# Altium schematic sheet Sch_pwr_brd_MCU.SchDoc
size A
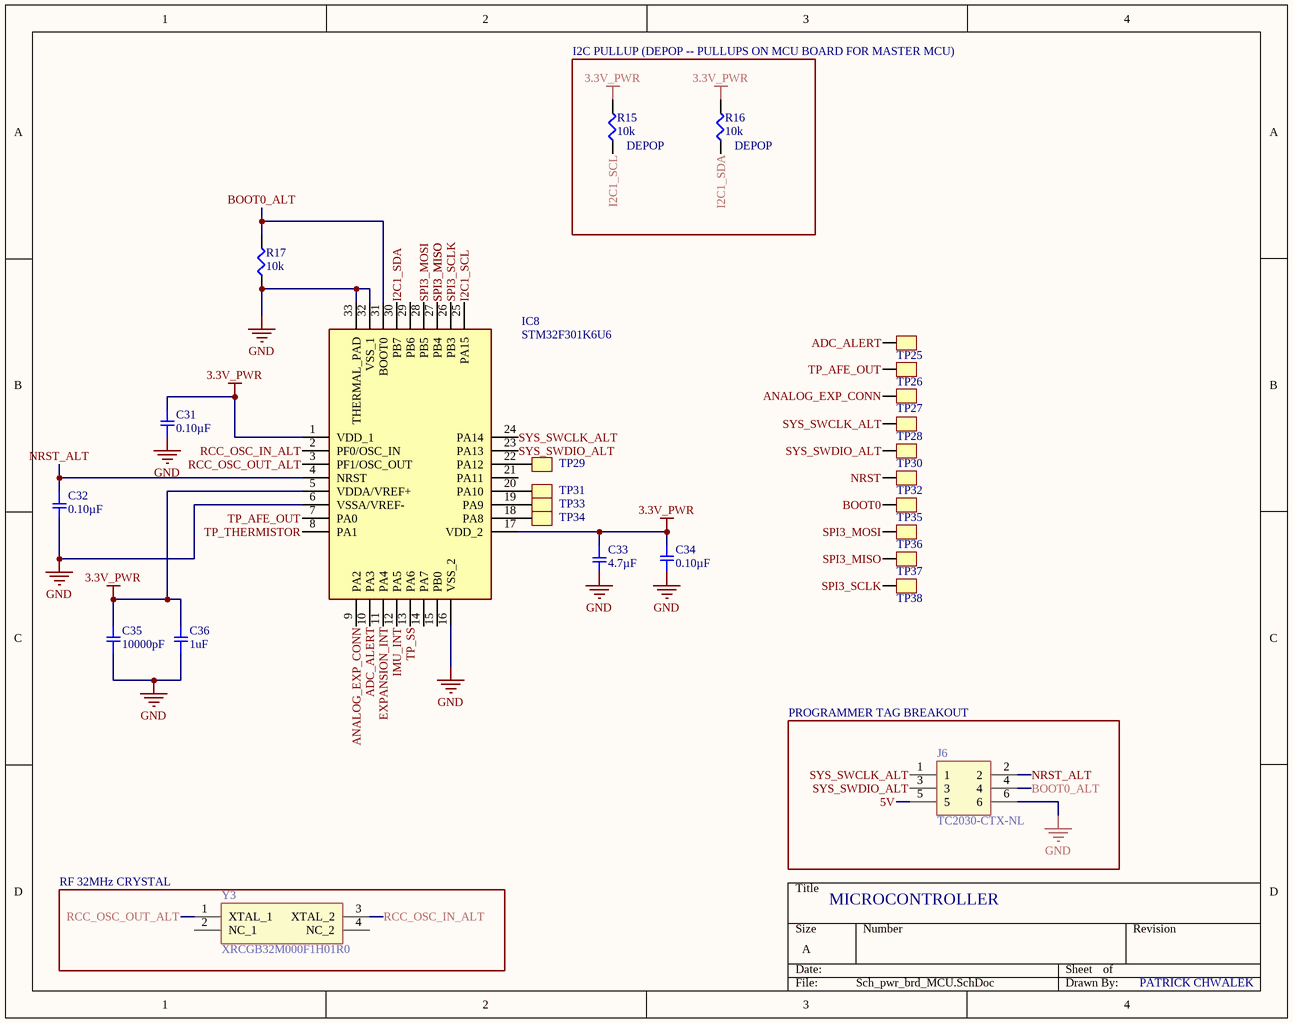
[diagram p0: Sch_pwr_brd_MCU.SchDoc]

## Parts
C31  0.10µF  [SMD-0402C]
C32  0.10µF  [SMD-0402C]
C33  4.7µF  [SMD-0402C]
C34  0.10µF  [SMD-0402C]
C35  10000pF  [SMD-0402C]
C36  1uF  [SMD-0402C]
IC8  STM32F301K6U6  [QFN50P500X500X60-33N-D]
J6  TC2030-CTX-NL  [TC2030MCPNL10]
R15  10k  [SMD-0402-RES]
R16  10k  [SMD-0402-RES]
R17  10k  [SMD-0402-RES]
TP25  TestPoint  [TestPoint_0.4mm]  (value not drawn)
TP26  TestPoint  [TestPoint_0.4mm]  (value not drawn)
TP27  TestPoint  [TestPoint_0.4mm]  (value not drawn)
TP28  TestPoint  [TestPoint_0.4mm]  (value not drawn)
TP29  TestPoint  [TESTPOINT_1MM_OVAL]  (value not drawn)
TP30  TestPoint  [TestPoint_0.4mm]  (value not drawn)
TP31  TestPoint  [TESTPOINT_1MM_OVAL]  (value not drawn)
TP32  TestPoint  [TestPoint_0.4mm]  (value not drawn)
TP33  TestPoint  [TESTPOINT_1MM_OVAL]  (value not drawn)
TP34  TestPoint  [TESTPOINT_1MM_OVAL]  (value not drawn)
TP35  TestPoint  [TestPoint_0.4mm]  (value not drawn)
TP36  TestPoint  [TestPoint_0.4mm]  (value not drawn)
TP37  TestPoint  [TestPoint_0.4mm]  (value not drawn)
TP38  TestPoint  [TestPoint_0.4mm]  (value not drawn)
Y3  XRCGB32M000F1H01R0  [XRCGB32M000F1H01R0]

## Blocks framed on the sheet
PROGRAMMER TAG BREAKOUT: J6
RF 32MHz CRYSTAL: Y3

## Nets
3.3V_PWR: C31.2 C33.1 C34.2 C35.2 C36.2 IC8.1(VDD_1) IC8.5(VDDA/VREF+) IC8.17(VDD_2) R15.2 R16.2
GND: C31.1 C32.2 C33.2 C34.1 C35.1 C36.1 IC8.6(VSSA/VREF-) IC8.16(VSS_2) IC8.32(VSS_1) IC8.33(THERMAL_PAD) J6.6 R17.1
5V: J6.5
ADC_ALERT: IC8.10(PA3) TP25.1
ANALOG_EXP_CONN: IC8.9(PA2) TP27.1
BOOT0: TP35.1
BOOT0_ALT: IC8.31(BOOT0) J6.4 R17.2
EXPANSION_INT: IC8.11(PA4)
I2C1_SCL: IC8.25(PA15) R15.1
I2C1_SDA: IC8.30(PB7) R16.1
IMU_INT: IC8.12(PA5)
NRST: TP32.1
NRST_ALT: C32.1 IC8.4(NRST) J6.2
RCC_OSC_IN_ALT: IC8.2(PF0/OSC_IN) Y3.3(XTAL_2)
RCC_OSC_OUT_ALT: IC8.3(PF1/OSC_OUT) Y3.1(XTAL_1)
SPI3_MISO: IC8.27(PB4) TP37.1
SPI3_MOSI: IC8.28(PB5) TP36.1
SPI3_SCLK: IC8.26(PB3) TP38.1
SYS_SWCLK_ALT: IC8.24(PA14) J6.1 TP28.1
SYS_SWDIO_ALT: IC8.23(PA13) J6.3 TP30.1
TP_AFE_OUT: IC8.7(PA0) TP26.1
TP_SS: IC8.13(PA6)
TP_THERMISTOR: IC8.8(PA1)
NetIC8_18: IC8.18(PA8) TP34.1
NetIC8_19: IC8.19(PA9) TP33.1
NetIC8_20: IC8.20(PA10) TP31.1
NetIC8_22: IC8.22(PA12) TP29.1

Not connected (* = marked no-connect by the designer): IC8 14(PA7) 15(PB0) 21(PA11) 29(PB6); Y3 2(NC_1) 4(NC_2)

## Notes on the sheet
- I2C PULLUP (DEPOP -- PULLUPS ON MCU BOARD FOR MASTER MCU)
- (near R15) DEPOP
- (near R16) DEPOP
- MICROCONTROLLER
- PATRICK CHWALEK

## Library data of the parts
C31 C32 C34 = GCM155R71C104KA55D: CAP CER 0.1UF 16V X7R 0402; Manufacturer: Murata Electronics North America; Factory Stock: 0; Unit Price (USD): 0.1; Minimum Quantity: 1; Tolerance: ±10%; Datasheets: http://www.murata.com/~/media/webrenewal/support/library/catalog/products/capacitor/mlcc/c03e.ashx; Image: //media.digikey.com/Renders/Murata%20Renders/ZRB-SERIES-0402.jpg; Digi-Key Part Number: 490-4759-1-ND; Part Number: GCM155R71C104KA55D; Quantity Available: 734194; @ qty: 0; Packaging: Cut Tape (CT); Series: GCM; Part Status: Active; Value: 0.10µF; Voltage: 16V; Temperature Coefficient: X7R; Operating Temperature: -55°C ~ 125°C; Features: -; Ratings: AEC-Q200; Applications: Automotive; Mounting Type: Surface Mount, MLCC; Package / Case: 0402 (1005 Metric); Size / Dimension: 0.039" L x 0.020" W (1.00mm x 0.50mm); Height - Seated (Max): -; Thickness (Max): 0.022" (0.55mm); Lead Spacing: -; Lead Style: -
C33 = GRM153R60G475ME15D: CAP CER 4.7UF 4V X5R 0402; Manufacturer: Murata Electronics North America; Factory Stock: 0; Unit Price (USD): 0.27; Minimum Quantity: 1; Tolerance: ±20%; Datasheets: http://psearch.en.murata.com/capacitor/product/GRM153R60G475ME15%23.pdf; Image: //media.digikey.com/Renders/Murata%20Renders/ZRB-SERIES-0402.jpg; Digi-Key Part Number: 490-13231-1-ND; Part Number: GRM153R60G475ME15D; Quantity Available: 9100; @ qty: 0; Packaging: Cut Tape (CT); Series: GRM; Part Status: Active; Value: 4.7µF; Voltage: 4V; Temperature Coefficient: X5R; Operating Temperature: -55°C ~ 85°C; Features: -; Ratings: -; Applications: General Purpose; Mounting Type: Surface Mount, MLCC; Package / Case: 0402 (1005 Metric); Size / Dimension: 0.039" L x 0.020" W (1.00mm x 0.50mm); Height - Seated (Max): -; Thickness (Max): 0.013" (0.33mm); Lead Spacing: -; Lead Style: -
C35 = GCM155R71H103KA55D: CAP CER 10000PF 50V X7R 0402; Manufacturer: Murata Electronics North America; Factory Stock: 0; Unit Price (USD): 0.1; Minimum Quantity: 1; Tolerance: ±10%; Datasheets: http://www.murata.com/~/media/webrenewal/support/library/catalog/products/capacitor/mlcc/c03e.ashx; Image: //media.digikey.com/Renders/Murata%20Renders/ZRB-SERIES-0402.jpg; Digi-Key Part Number: 490-4762-1-ND; Part Number: GCM155R71H103KA55D; Quantity Available: 650067; @ qty: 0; Packaging: Cut Tape (CT); Series: GCM; Part Status: Active; Value: 10000pF; Voltage: 50V; Temperature Coefficient: X7R; Operating Temperature: -55°C ~ 125°C; Features: -; Ratings: AEC-Q200; Applications: Automotive; Mounting Type: Surface Mount, MLCC; Package / Case: 0402 (1005 Metric); Size / Dimension: 0.039" L x 0.020" W (1.00mm x 0.50mm); Height - Seated (Max): -; Thickness (Max): 0.022" (0.55mm); Lead Spacing: -; Lead Style: -
C36 = GCM155R71H103KA55D: CAP CER 1UF 0402; Part Number: JMK105BJ105KP-F; Manufacturer: Murata Electronics North America; Factory Stock: 0; Unit Price (USD): 0.1; Minimum Quantity: 1; Tolerance: ±10%; Voltage: 50V; Temperature Coefficient: X7R; Datasheets: http://www.murata.com/~/media/webrenewal/support/library/catalog/products/capacitor/mlcc/c03e.ashx; Image: //media.digikey.com/Renders/Murata%20Renders/ZRB-SERIES-0402.jpg; Digi-Key Part Number: 490-4762-1-ND; Quantity Available: 650067; @ qty: 0; Packaging: Cut Tape (CT); Series: GCM; Part Status: Active; Value: 1uF; Operating Temperature: -55°C ~ 125°C; Features: -; Ratings: AEC-Q200; Applications: Automotive; Mounting Type: Surface Mount, MLCC; Package / Case: 0402 (1005 Metric); Size / Dimension: 0.039" L x 0.020" W (1.00mm x 0.50mm); Height - Seated (Max): -; Thickness (Max): 0.022" (0.55mm); Lead Spacing: -; Lead Style: -
IC8 = STM32F301K6U6: Integrated Circuit; Manufacturer_Name: STMicroelectronics; Datasheet Link: http://www.mouser.com/ds/2/389/stm32f301c6-956213.pdf; Height: 0.6mm; Manufacturer_Part_Number: STM32F301K6U6; Mouser Part Number: 511-STM32F301K6U6; Mouser Price/Stock: https://www.mouser.com/Search/Refine.aspx?Keyword=511-STM32F301K6U6
J6 = TC2030-CTX-NL: Connector; Manufacturer_Name: Tag Connect; Datasheet Link: http://www.tag-connect.com/Materials/TC2030-CTX.pdf; Height: 18mm; Manufacturer_Part_Number: TC2030-CTX-NL
R15-R17 = ERJ-2GEJ103X: RES SMD 10K OHM 5% 1/10W 0402; Manufacturer: Panasonic Electronic Components; Factory Stock: 0; Unit Price (USD): 0.00350; @ qty: 1500; Minimum Quantity: 1; Power (Watts): 0.1W, 1/10W; Temperature Coefficient: ±200ppm/°C; Part Number: ERJ-2GEJ103X; Datasheets: http://industrial.panasonic.com/www-cgi/jvcr13pz.cgi?E+PZ+3+AOA0001+ERJ2GEJ103X+7+WW; Image: //media.digikey.com/Photos/Panasonic%20Photos/ERJ-PA2-Series.jpg; Digi-Key Part Number: P10KJCT-ND; Quantity Available: 2560215; Packaging: Cut Tape (CT); Series: ERJ; Part Status: Active; Value: 10k; Tolerance: ±5%; Composition: Thick Film; Features: Automotive AEC-Q200; Operating Temperature: -55°C ~ 155°C; Package / Case: 0402 (1005 Metric); Supplier Device Package: 0402; Size / Dimension: 0.039" L x 0.020" W (1.00mm x 0.50mm); Height - Seated (Max): 0.016" (0.40mm); Number of Terminations: 2; Failure Rate: -
Y3 = XRCGB32M000F1H01R0: Crystal or Oscillator; Manufacturer_Name: Murata Electronics; Datasheet Link: https://www.murata.com/en-eu/products/productdetail?partno=XRCGB32M000F1H01R0; Height: 0.7mm; Manufacturer_Part_Number: XRCGB32M000F1H01R0; Mouser Part Number: 81-XRCGB32M000F1H01R; Mouser Price/Stock: https://www.mouser.com/Search/Refine.aspx?Keyword=81-XRCGB32M000F1H01R